# Altium schematic sheet Sheet4.SchDoc
size A4
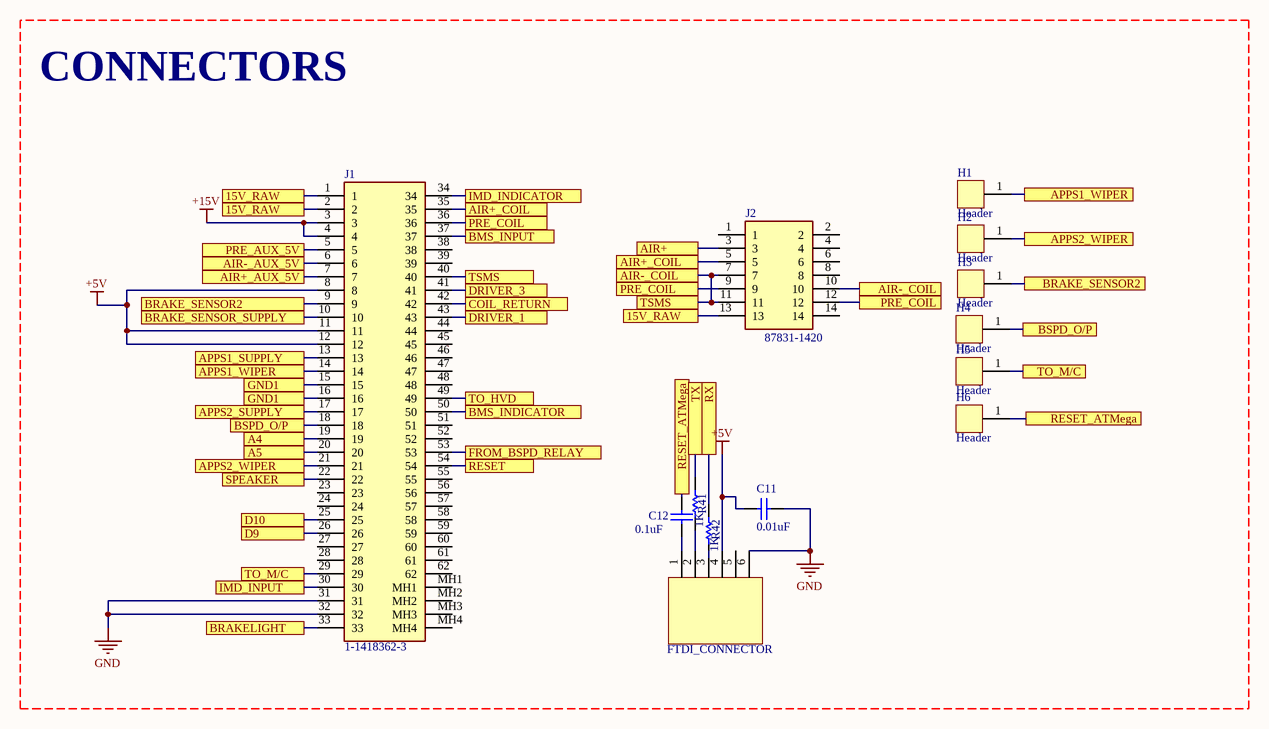
[diagram p0: Sheet4.SchDoc]

## Parts
2  FTDI_connector  [FTDI]  (value not drawn)
C11  0.01uF  [KEMT-1206-2_N]
C12  0.1uF  [KEMT-1206-2_N]
H1  Header  [Header]
H2  Header  [Header]
H3  Header  [Header]
H4  Header  [Header]
H5  Header  [Header]
H6  Header  [Header]
J1  1-1418362-3  [114183623]
J2  87831-1420  [SHDR14W55P200_2X7_1665X630X640P]
R41  1K  [R1206]
R42  1K  [R1206]

## Blocks framed on the sheet
CONNECTORS: 2 C11 C12 H1-H6 J1 J2 R41 R42

## Ports
15V_RAW, A4, A5, AIR+, AIR+_AUX_5V, AIR+_COIL, AIR-_AUX_5V, AIR-_COIL, APPS1_SUPPLY, APPS1_WIPER, APPS2_SUPPLY, APPS2_WIPER, BMS_INDICATOR, BMS_INPUT, BRAKE_SENSOR2, BRAKE_SENSOR_SUPPLY, BRAKELIGHT, BSPD_O/P, COIL_RETURN, D9, D10, DRIVER_1, DRIVER_3, FROM_BSPD_RELAY, GND1, IMD_INDICATOR, IMD_INPUT, PRE_AUX_5V, PRE_COIL, RESET, RESET_ATMega, RX, SPEAKER, TO_HVD, TO_M/C, TSMS, TX

## Nets
+5V: 2.4 C11.2 J1.8 J1.11 J1.12
+15V: J1.3 J1.4
GND: 2.6 C11.1 J1.31 J1.32
15V_RAW: J1.1 J1.2 J2.13 ; port 15V_RAW
A4: J1.19 ; port A4
A5: J1.20 ; port A5
AIR+: J2.3 ; port AIR+
AIR+_AUX_5V: J1.7 ; port AIR+_AUX_5V
AIR+_COIL: J1.35 J2.5 ; port AIR+_COIL
AIR-_AUX_5V: J1.6 ; port AIR-_AUX_5V
AIR-_COIL: J1.40 J2.7 J2.10 J2.11 ; port AIR-_COIL, port TSMS
APPS1_SUPPLY: J1.13 ; port APPS1_SUPPLY
APPS1_WIPER: H1.1 J1.14 ; port APPS1_WIPER
APPS2_SUPPLY: J1.17 ; port APPS2_SUPPLY
APPS2_WIPER: H2.1 J1.21 ; port APPS2_WIPER
BMS_INDICATOR: J1.50 ; port BMS_INDICATOR
BMS_INPUT: J1.37 ; port BMS_INPUT
BRAKE_SENSOR2: H3.1 J1.9 ; port BRAKE_SENSOR2
BRAKE_SENSOR_SUPPLY: J1.10 ; port BRAKE_SENSOR_SUPPLY
BRAKELIGHT: J1.33 ; port BRAKELIGHT
BSPD_O/P: H4.1 J1.18 ; port BSPD_O/P
COIL_RETURN: J1.42 ; port COIL_RETURN
D9: J1.26 ; port D9
D10: J1.25 ; port D10
DRIVER_1: J1.43 ; port DRIVER_1
DRIVER_3: J1.41 ; port DRIVER_3
FROM_BSPD_RELAY: J1.53 ; port FROM_BSPD_RELAY
GND1: J1.15 J1.16 ; port GND1
IMD_INDICATOR: J1.34 ; port IMD_INDICATOR
IMD_INPUT: J1.30 ; port IMD_INPUT
PRE_AUX_5V: J1.5 ; port PRE_AUX_5V
PRE_COIL: J1.36 J2.9 J2.12 ; port PRE_COIL
RESET: J1.54 ; port RESET
RESET_ATMega: C12.2 H6.1 ; port RESET_ATMega
RX: R42.2 ; port RX
SPEAKER: J1.22 ; port SPEAKER
TO_HVD: J1.49 ; port TO_HVD
TO_M/C: H5.1 J1.29 ; port TO_M/C
TX: R41.2 ; port TX
Net2_1: 2.1 C12.1
Net2_2: 2.2 R41.1
Net2_3: 2.3 R42.1

Not connected (* = marked no-connect by the designer): 2 5(2); J1 23 24 27 28 38 39 44 45 46 47 48 51 52 55 56 57 58 59 60 61 62 MH1 MH2 MH3 MH4; J2 1 2 4 6 8 14

## Notes on the sheet
- (in symbol FTDI_connector) FTDI_CONNECTOR

## Library data of the parts
C11 C12 = CMP-1037-04202-2: CAP, Ceramic, 0.1 uF, +/- 10%, 50 V, -55 to 125 degC, 1206 (3216 Metric), RoHS, Tape and Reel; Manufacturer: Kemet; Voltage Rating: 50V; Capacitance: 0.1µF; Product Range: KEMET-CSeries; SVHC: ToBeAdvised; Dielectric Characteristic: X7R; Capacitor Case Style: 1206[3216Metric]; Package Reference: 1206-2; Package Description: 2-Leads SMD, Body 3.2 x 1.6 mm; Packaging: Tape&Reel; Operating Temperature Max: 125degC; Capacitance Tolerance: ±10%; Datasheet URL: https://datasheet.ciiva.com/6125/1725438-6125494.pdf; Manufacturer URL: http://www.kemet.com/; Operating Temperature Min: -55degC; Datasheet Version: Jul-13
J1 = 1-1418362-3: Connector; Manufacturer_Name: TE Connectivity; Datasheet Link: https://www.arrow.com/en/products/1-1418362-3/te-connectivity; Height: 48mm; Manufacturer_Part_Number: 1-1418362-3; Mouser Part Number: 571-1-1418362-3; Mouser Price/Stock: https://www.mouser.co.uk/ProductDetail/TE-Connectivity-AMP/1-1418362-3?qs=J7fCQMU5Gej7aVw8AejcvQ%3D%3D; Arrow Part Number: 1-1418362-3; Arrow Price/Stock: https://www.arrow.com/en/products/1-1418362-3/te-connectivity
J2 = 87831-1420: Connector; Manufacturer_Name: Molex; Datasheet Link: http://docs-emea.rs-online.com/webdocs/150d/0900766b8150deae.pdf; Height: 6.4mm; Manufacturer_Part_Number: 87831-1420; Mouser Part Number: 538-87831-1420; Mouser Price/Stock: https://www.mouser.co.uk/ProductDetail/Molex/87831-1420/?qs=QtQX4uD3c2VDCL534TqpVg%3D%3D
R41 R42 = RES: Part Number: CRCW120647K0FKEA; Manufacturer: Vishay Dale